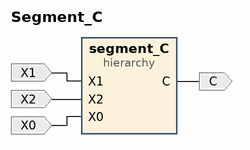
[diagram p0: block diagram of the top level]
# Vivado block design Segment_C, xc7a35tcpg236-1, Vivado 2018.3
create_bd_design Segment_C

create_bd_port -dir I X1
create_bd_port -dir O C
create_bd_port -dir I X2
create_bd_port -dir I X0

create_bd_cell -type hier segment_C

# ---- hierarchy /segment_C ----
current_bd_instance /segment_C
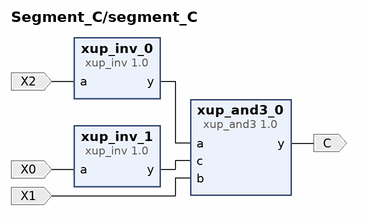
[diagram p1: block diagram inside /segment_C]
create_bd_pin -dir I X1
create_bd_pin -dir O C
create_bd_pin -dir I X2
create_bd_pin -dir I X0

create_bd_cell -type ip -vlnv xilinx.com:xup:xup_and3:1.0 xup_and3_0
set_property -dict {CONFIG.DELAY 0} [get_bd_cells xup_and3_0]
create_bd_cell -type ip -vlnv xilinx.com:xup:xup_inv:1.0 xup_inv_0
set_property -dict {CONFIG.DELAY 0} [get_bd_cells xup_inv_0]
create_bd_cell -type ip -vlnv xilinx.com:xup:xup_inv:1.0 xup_inv_1
set_property -dict {CONFIG.DELAY 0} [get_bd_cells xup_inv_1]

# ---- connections ----

current_bd_instance /segment_C
connect_bd_net [get_bd_pins xup_inv_0/y] [get_bd_pins xup_and3_0/a]
connect_bd_net [get_bd_pins xup_inv_1/y] [get_bd_pins xup_and3_0/c]
connect_bd_net -net b_0_1 [get_bd_pins X1] [get_bd_pins xup_and3_0/b]
connect_bd_net [get_bd_pins xup_and3_0/y] [get_bd_pins C]
connect_bd_net -net a_0_1 [get_bd_pins X2] [get_bd_pins xup_inv_0/a]
connect_bd_net -net a_1_1 [get_bd_pins X0] [get_bd_pins xup_inv_1/a]

current_bd_instance /
connect_bd_net -net b_0_1 [get_bd_ports X1] [get_bd_pins segment_C/X1]
connect_bd_net -net xup_and3_0_y [get_bd_pins segment_C/C] [get_bd_ports C]
connect_bd_net -net a_0_1 [get_bd_ports X2] [get_bd_pins segment_C/X2]
connect_bd_net -net a_1_1 [get_bd_ports X0] [get_bd_pins segment_C/X0]

validate_bd_design
save_bd_design
